# EAGLE design Adafruit ESP8266 Feather rev E (EAGLE 9.6.2)
COMPANY: ADAFRUIT INDUSTRIES; DRAWN: KTOWN; REV: B
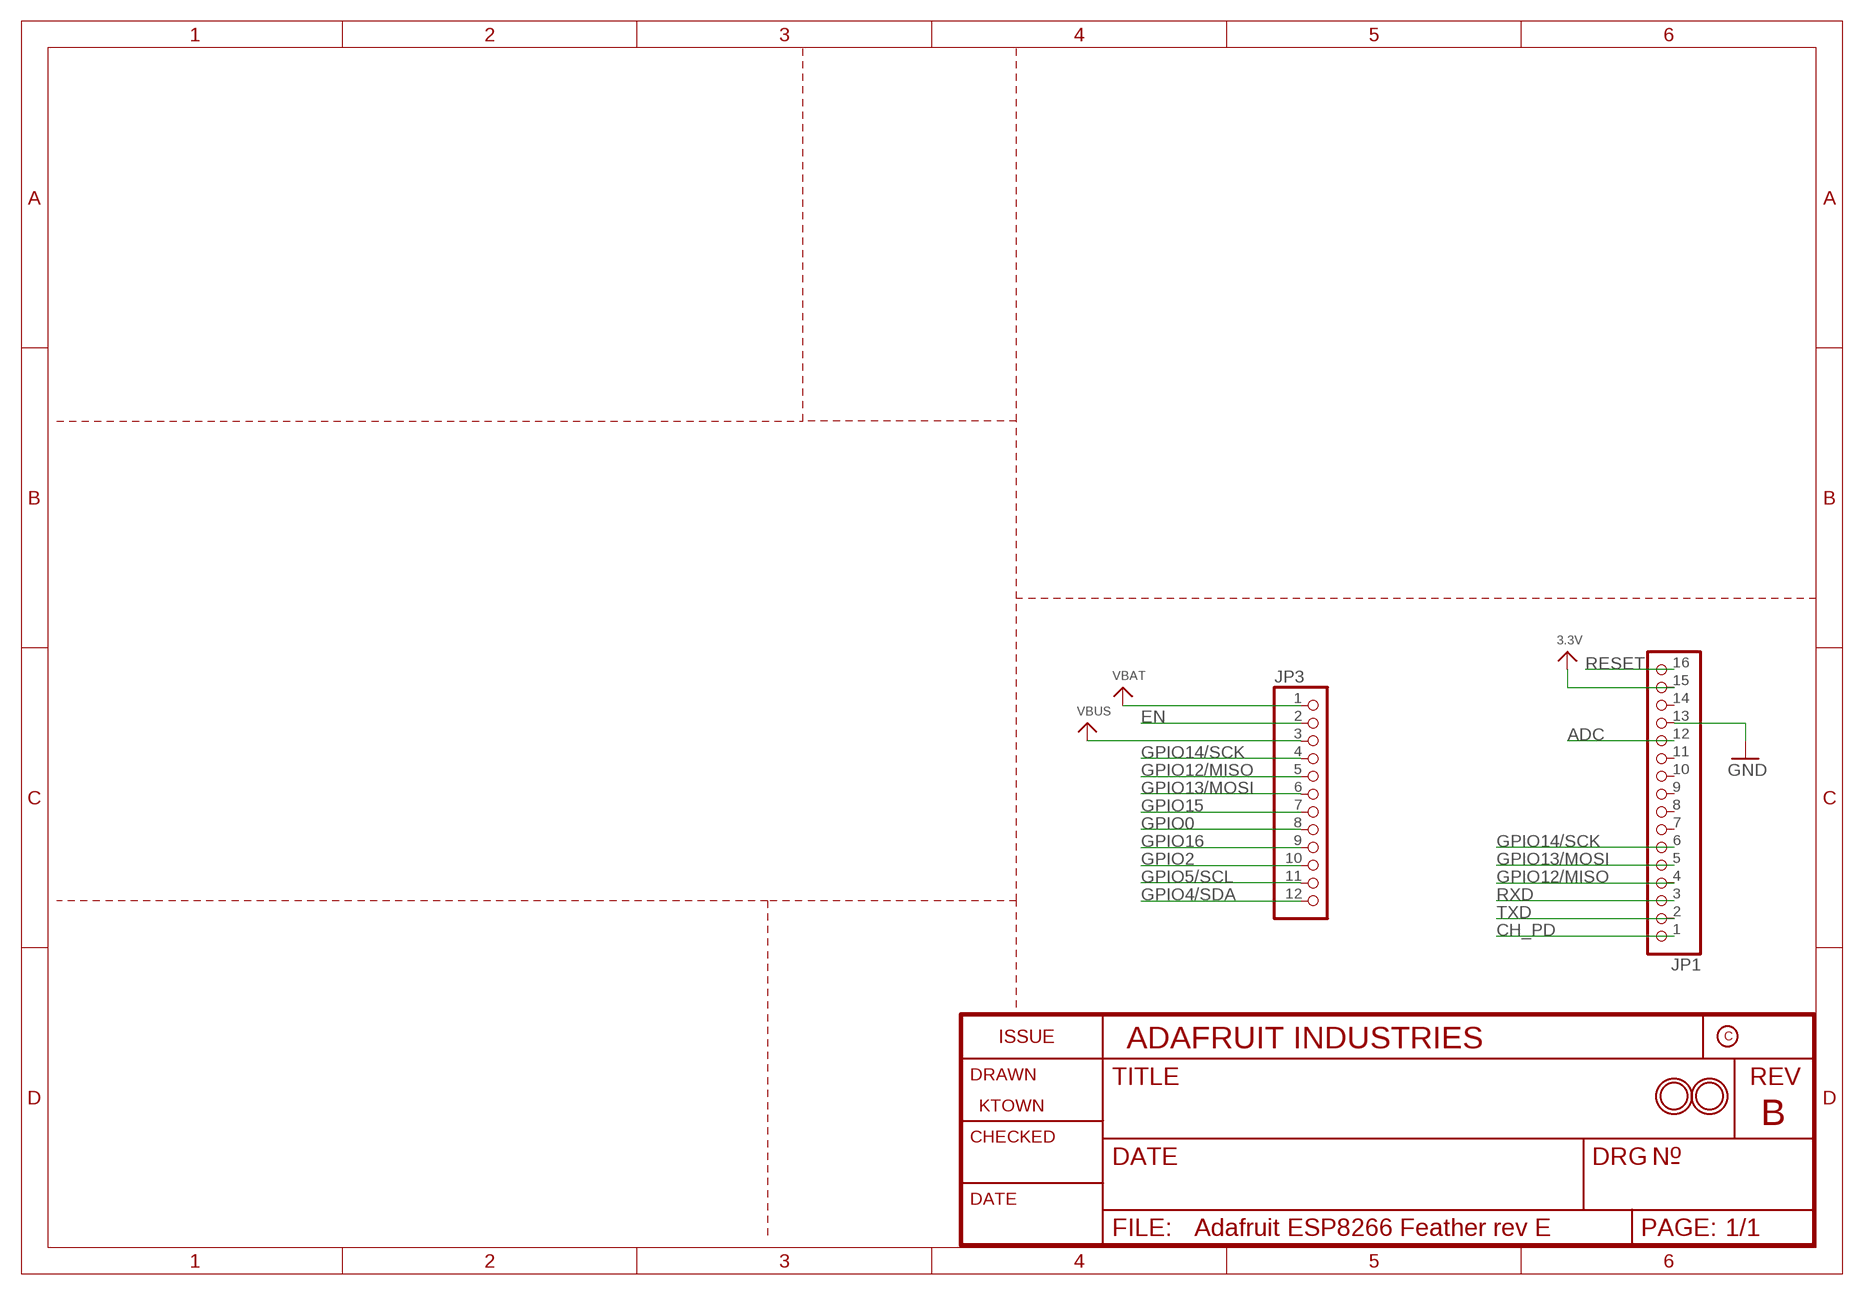
[diagram p0: schematic, sheet 1]

## Parts
JP1  HEADER-1X16ROUND  [1X16_ROUND]
JP3  HEADER-1X12  [1X12_ROUND]
U$31  MOUNTINGHOLE2.5  [MOUNTINGHOLE_2.5_PLATED]
U$32  MOUNTINGHOLE2.5  [MOUNTINGHOLE_2.5_PLATED]

## Nets
3.3V: JP1.15
ADC: JP1.12
CH_PD: JP1.1
EN: JP3.2
GND: JP1.13
GPIO0: JP3.8
GPIO2: JP3.10
GPIO4/SDA: JP3.12
GPIO5/SCL: JP3.11
GPIO12/MISO: JP1.4 JP3.5
GPIO13/MOSI: JP1.5 JP3.6
GPIO14/SCK: JP1.6 JP3.4
GPIO15: JP3.7
GPIO16: JP3.9
RESET: JP1.16
RXD: JP1.3
TXD: JP1.2
VBAT: JP3.1
VBUS: JP3.3
Unconnected: JP1.7 JP1.8 JP1.9 JP1.10 JP1.11 JP1.14

## Library data of the parts
JP1 = microbuilder:HEADER-1X16: PIN HEADER
JP3 = microbuilder:HEADER-1X12
U$31 U$32 = microbuilder:MOUNTINGHOLE: Mounting Hole For #2 screws (0.086"/2.18mm width, 0.094"/2.4mm hole) use 2.5mm; BOM: EXCLUDE

## Board
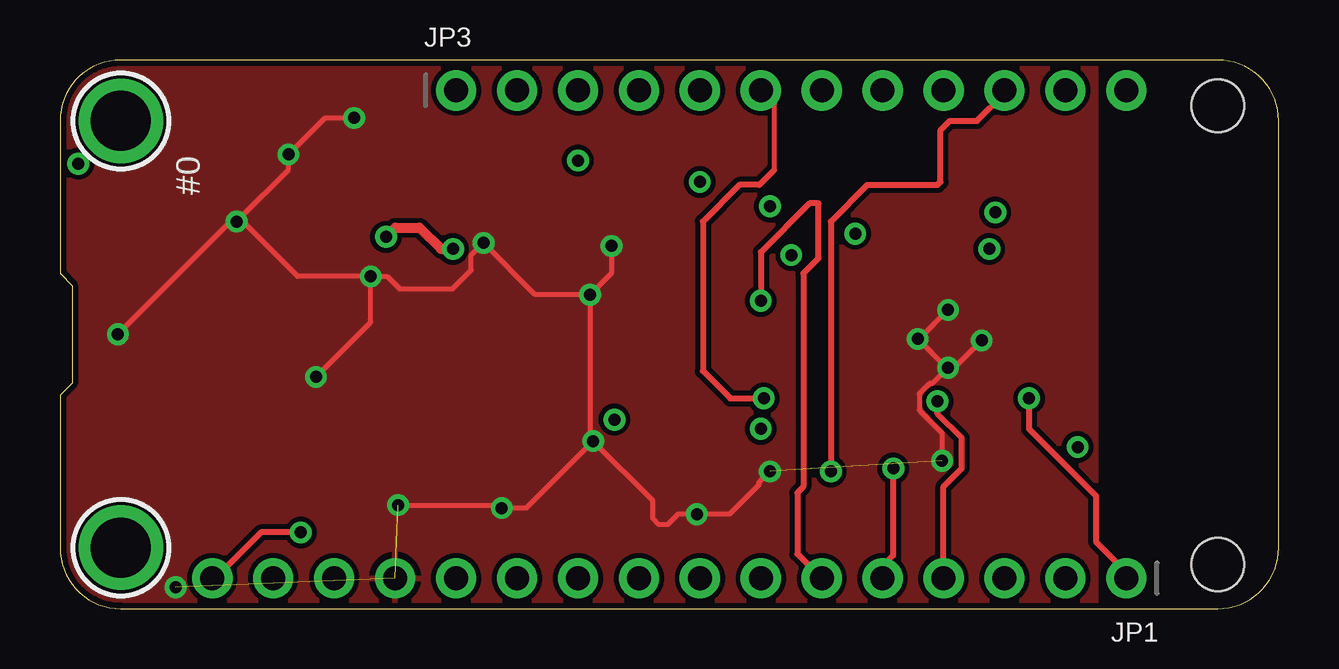
[diagram p1: board, top side]
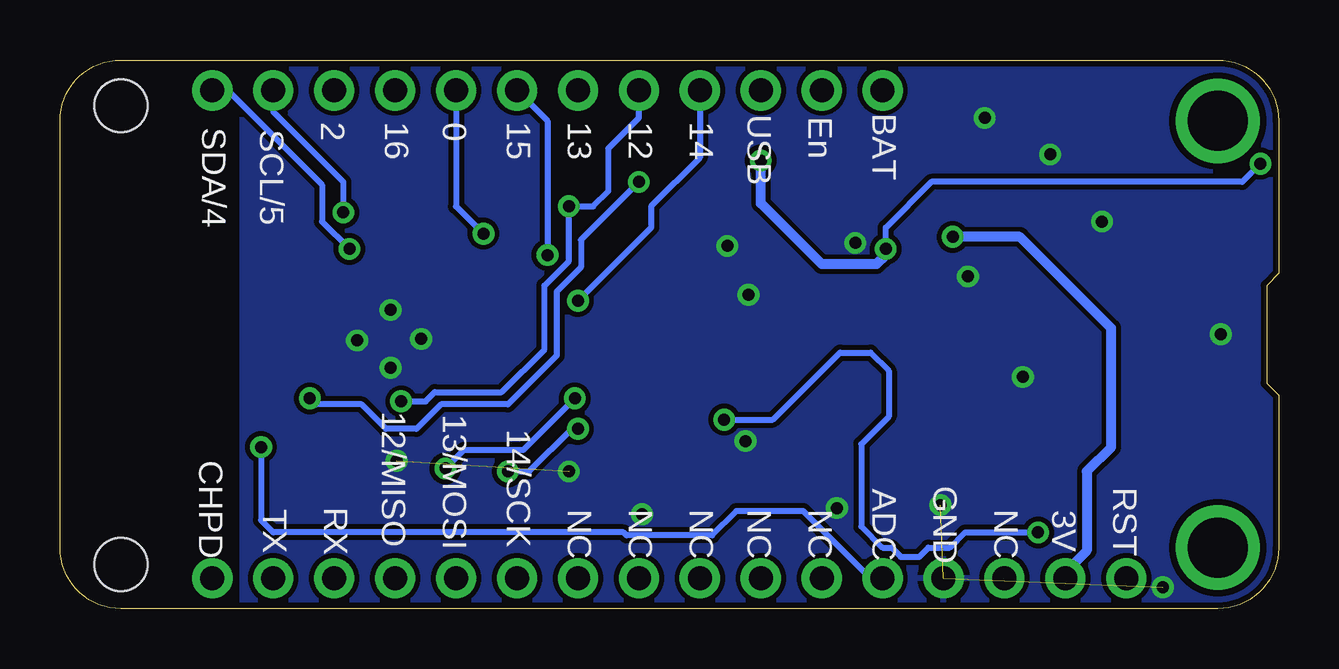
[diagram p2: board, bottom side, seen from below]

Size 50.8 x 22.86 mm. Coordinates in mm from the lower left corner, seen from the top.
Outline: 2.54,0 48.26,0 arc90 50.8,2.54 50.8,20.32 arc90 48.26,22.86 2.54,22.86 arc90 0,20.32 0,13.97 0.51,13.46 0.51,9.4 0,8.89 0,2.54 arc90 2.54,0
Copper layers (1*16): Top 0.035mm / dielectric 1.5mm / Bottom 0.035mm
Design rules "adafruit *": minimum track width 8mil, minimum drill 15.5mil, track to track 8mil, track to pad 8mil, pad to pad 8mil, via to via 8mil, smd to smd 8mil, copper to edge 10mil, drill to drill 8mil, minimum pad ring 10mil, minimum via ring 8mil, stop-mask expansion 2mil, vias tented up to drill 20mil, thermal gap 10mil
Holes 2.2 mm at 48.26,1.84 48.26,20.95

### Footprints (pad centres in the part's own frame; a part is rotated, then mirrored left to right if it is on the bottom)
1X16_ROUND = drill 1 pad 1.676: 1 -19.05,0; 2 -16.51,0; 3 -13.97,0; 4 -11.43,0; 5 -8.89,0; 6 -6.35,0; 7 -3.81,0; 8 -1.27,0; 9 1.27,0; 10 3.81,0; 11 6.35,0; 12 8.89,0; 13 11.43,0; 14 13.97,0; 15 16.51,0; 16 19.05,0
1X12_ROUND = drill 1 pad 1.676: 1 -13.97,0; 2 -11.43,0; 3 -8.89,0; 4 -6.35,0; 5 -3.81,0; 6 -1.27,0; 7 1.27,0; 8 3.81,0; 9 6.35,0; 10 8.89,0; 11 11.43,0; 12 13.97,0
MOUNTINGHOLE_2.5_PLATED = drill 2.5 pad 3.2: P$1 0,0

### Placement (x,y rotation side)
JP1  25.4,1.27 180 top
JP3  30.48,21.59 0 top
U$31  2.54,20.32 270 top
U$32  2.54,2.54 270 top

### Tracks (layer width: path | path; a pad name or v marks a point on that pad's centre or on a via)
3.3V  (via drill 0.5)
  Top 0.406: v13.59,15.49 13.97,15.88 14.99,15.88 15.88,14.99 v16.38,14.99
  Bottom 0.254: v0.76,18.54 1.52,17.78 14.48,17.78 16.38,15.88 v16.38,14.99 16.38,14.73
  Bottom 0.406: v13.59,15.49 10.79,15.49 6.99,11.68 6.99,6.73 8,5.71 8,2.41 8.89,1.52 JP1.15 | 16.38,14.73 16.76,14.35 19.05,14.35 21.59,16.89 v21.59,18.67
ADC  (via drill 0.5)
  Bottom 0.254: JP1.12 17.02,1.27 19.81,4.06 22.61,4.06 23.62,3.05 27.18,3.05 27.3,3.17 41.91,3.17 42.42,3.68 v42.42,6.73
CH_PD  (via drill 0.5)
  Top 0.254: v40.39,8.76 40.39,7.49 43.18,4.7 43.18,2.79 44.45,1.52 JP1.1
  Bottom 0.254: v40.39,8.76 40.13,8.51 38.23,8.51 37.21,7.49 35.94,7.49 34.92,8.51 32.13,8.51 30.1,10.54 30.1,13.21 29.08,14.22 29.08,15.37 v26.67,17.78
GND  (via drill 0.5)  (3 unrouted)
  Top 0.203: v7.37,16.13 7.49,16.26 | 7.49,16.26 9.53,18.29 v9.53,18.92 11.05,20.45 v12.26,20.45 | v2.41,11.43 7.24,16.26 7.49,16.26 | v10.67,9.65 12.95,11.94 v12.95,13.84 | v12.95,13.84 9.91,13.84 7.49,16.26 | v12.95,13.84 13.63,13.84 14.16,13.32 16.36,13.32 17.14,14.11 17.14,14.73 v17.65,15.24 19.81,13.08 v22.1,13.08 | v22.1,13.08 22.1,7.11 v22.23,6.99 | v22.99,15.11 22.99,13.97 v22.1,13.08 | v22.23,6.99 19.43,4.19 v18.41,4.19 18.29,4.32 v14.1,4.32 | v37.02,10.03 37.27,10.03 v38.42,11.18 | v37.02,10.03 36.96,10.03 v35.75,11.24 35.81,11.24 v37.02,12.45 | v37.02,10.03 36.38,9.39 36.26,9.39 35.82,8.95 35.82,8.28 36.77,7.33 v36.77,6.16 | v22.23,6.99 24.71,4.5 24.71,3.76 24.97,3.5 25.32,3.5 25.76,3.94 v26.54,3.94 27.92,3.94 29.13,5.16 29.13,5.26 v29.59,5.71
  other vias: 4.83,0.89
  pour Top: 0,22.86 0,0 43.18,0 43.18,22.86
  pour Bottom: -0.13,0.25 43.18,0 43.18,22.86 0,22.86
GPIO0  (via drill 0.5)
  Bottom 0.254: JP3.8 34.29,16.76 v33.15,15.62
GPIO2  (via drill 0.5)
  Top 0.254: JP3.10 39.37,21.46 38.23,20.32 37.08,20.32 36.7,19.94 36.7,17.78 36.58,17.65 33.66,17.65 32.13,16.13 v32.13,5.71
  Bottom 0.254: v32.13,5.71 31.24,5.71 29.46,7.49 v29.21,7.49
GPIO4/SDA  (via drill 0.5)
  Bottom 0.254: JP3.12 43.81,21.59 39.88,17.65 39.88,16.13 v38.73,14.99
GPIO5/SCL  (via drill 0.5)
  Bottom 0.254: JP3.11 41.91,20.7 38.99,17.78 v38.99,16.51
GPIO12/MISO  (via drill 0.5)
  Top 0.254: JP1.4 36.83,5.08 37.59,5.84 37.59,7.11 36.58,8.13 v36.58,8.64
  Bottom 0.254: JP3.5 26.67,20.45 27.94,19.18 27.94,17.4 28.57,16.76 v29.59,16.76 29.59,14.48 30.61,13.46 30.61,10.79 32.38,9.02 35.18,9.02 35.56,8.64 v36.58,8.64
GPIO13/MOSI  (via drill 0.5)
  Top 0.203: 29.77,18.28 29.77,21.03
  Top 0.254: JP1.5 34.29,1.78 34.73,2.22 v34.73,5.84 | 29.77,21.03 JP3.6 | 29.77,18.28 29.15,17.65 28.32,17.65 26.8,16.13 26.8,9.91 27.94,8.76 v29.34,8.76
  Bottom 0.254: v29.34,8.76 31.5,6.6 33.97,6.6 v34.73,5.84
GPIO14/SCK  (via drill 0.5)
  Top 0.254: v29.21,12.83 29.21,14.86 31.24,16.89 31.62,16.89 31.62,14.61 30.99,13.97 30.99,5.08 30.73,4.83 30.73,2.29 JP1.6
  Bottom 0.254: JP3.4 24.13,18.8 26.16,16.76 26.16,15.88 v29.21,12.83
GPIO15  (via drill 0.5)
  Bottom 0.254: JP3.7 30.48,20.32 v30.48,14.73
RESET  (via drill 0.5)
  Top 0.254: JP1.16 6.48,1.27 8.38,3.17 v10.03,3.17
  Bottom 0.254: v23.11,7.87 21.08,7.87 18.29,10.67 17.02,10.67 16.26,9.91 16.26,8 17.4,6.86 17.4,3.43 16.51,2.54 16.13,2.54 15.75,2.16 14.99,2.16 14.61,2.54 13.72,2.54 13.08,3.17 v10.03,3.17

### Text on the board
tPlace: #0
bPlace: En | 0 | 2 | BAT | USB | 14 | 12 | 13 | 15 | 16 | SCL/5 | SDA/4 | 14/SCK | 13/MOSI | 12/MISO | RST | CHPD | 3V | NC | GND | ADC | NC | NC | NC | NC | NC | RX | TX